# EAGLE design Keyboard (EAGLE 8.5.1)
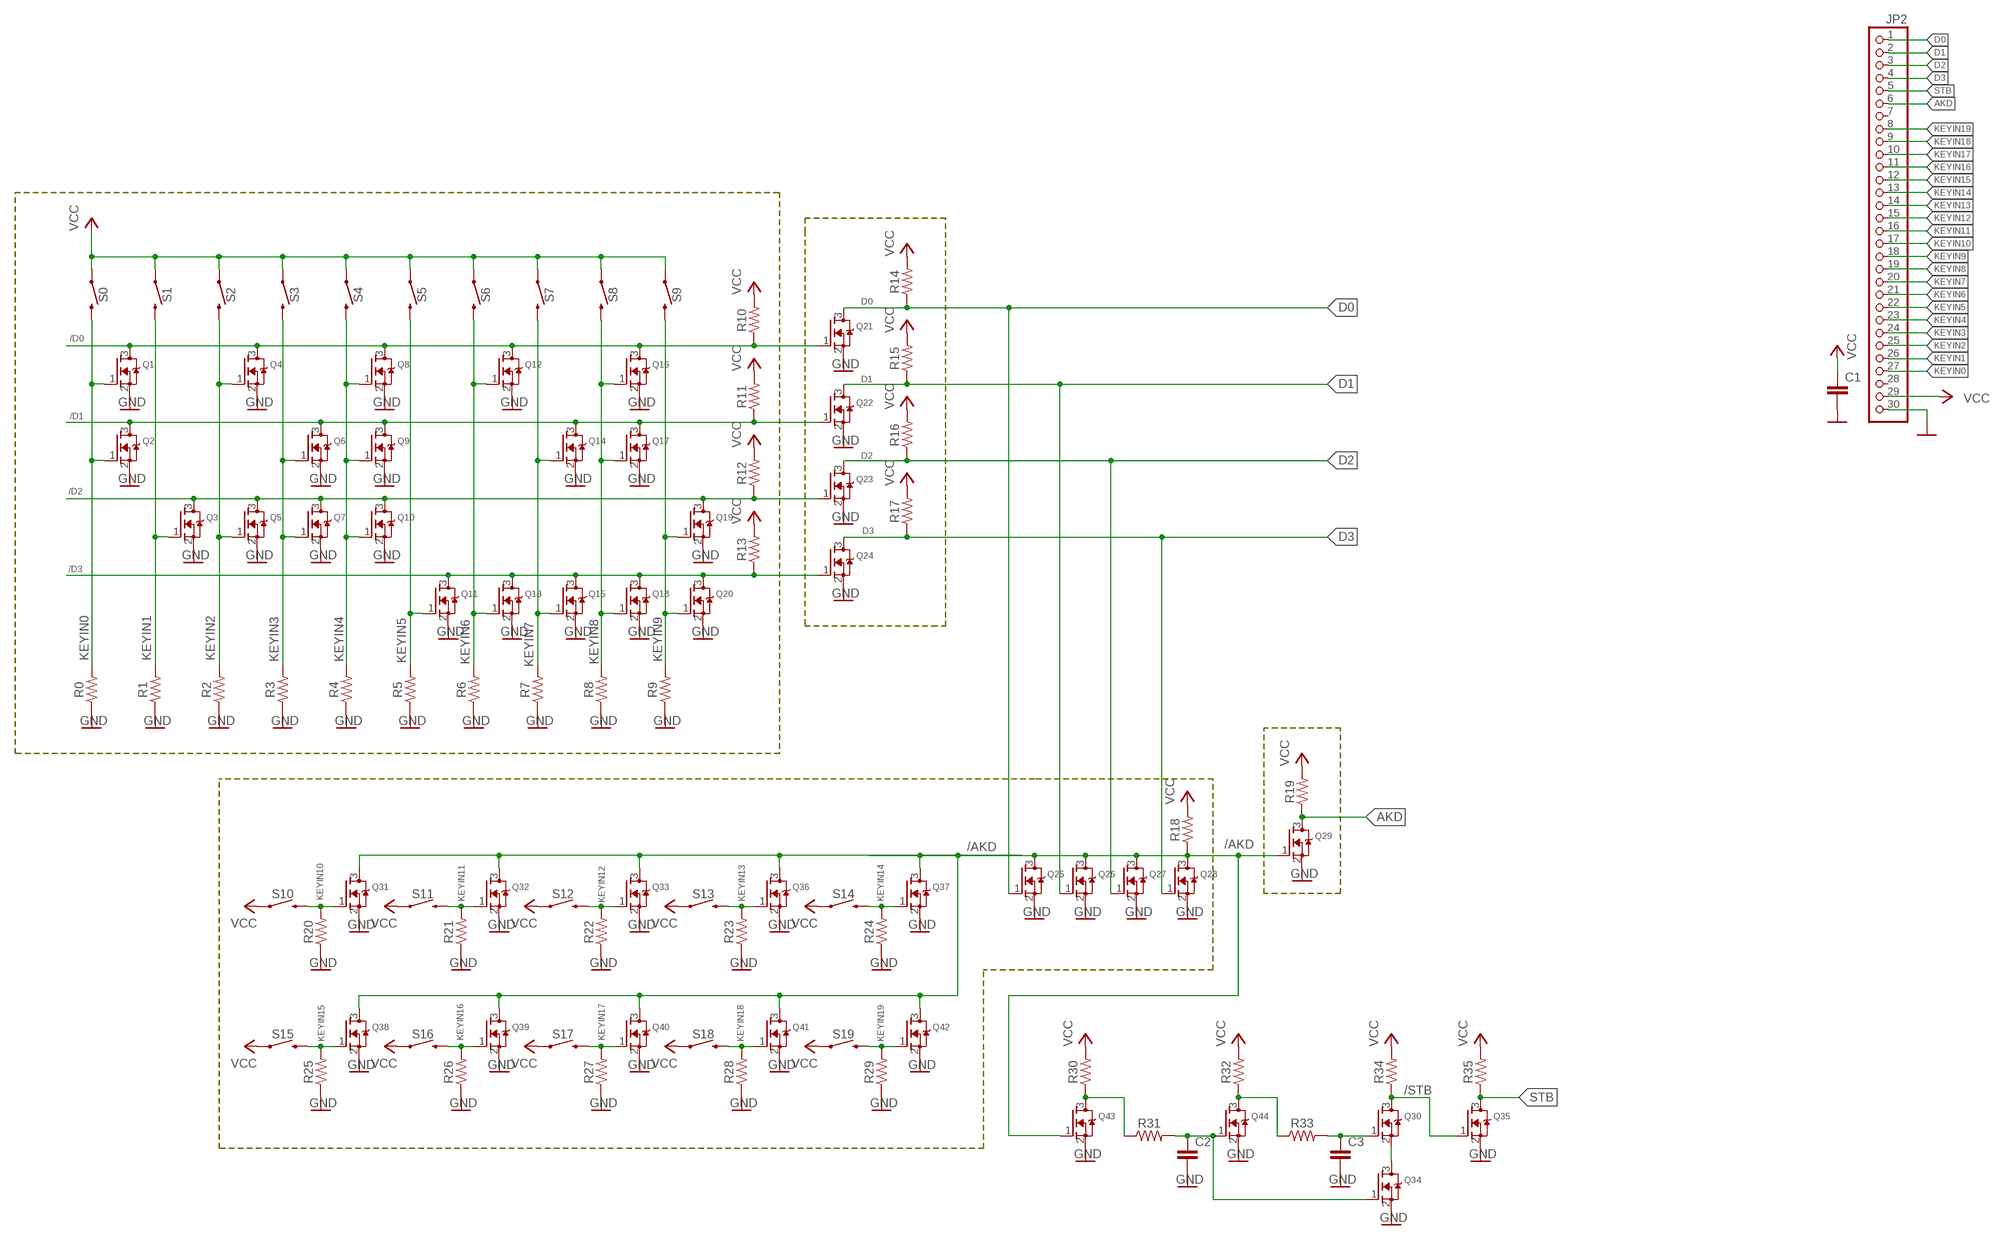
[diagram p0: schematic, sheet 1]

## Parts
C1  C-EUC0805K  [C0805K]
C2  C-EUC0805K  [C0805K]
C3  C-EUC0805K  [C0805K]
JP2  PINHD-1X30  [1X30]
Q1  NMOSREFLOW  [SOT23]
Q2  NMOSREFLOW  [SOT23]
Q3  NMOSREFLOW  [SOT23]
Q4  NMOSREFLOW  [SOT23]
Q5  NMOSREFLOW  [SOT23]
Q6  NMOSREFLOW  [SOT23]
Q7  NMOSREFLOW  [SOT23]
Q8  NMOSREFLOW  [SOT23]
Q9  NMOSREFLOW  [SOT23]
Q10  NMOSREFLOW  [SOT23]
Q11  NMOSREFLOW  [SOT23]
Q12  NMOSREFLOW  [SOT23]
Q13  NMOSREFLOW  [SOT23]
Q14  NMOSREFLOW  [SOT23]
Q15  NMOSREFLOW  [SOT23]
Q16  NMOSREFLOW  [SOT23]
Q17  NMOSREFLOW  [SOT23]
Q18  NMOSREFLOW  [SOT23]
Q19  NMOSREFLOW  [SOT23]
Q20  NMOSREFLOW  [SOT23]
Q21  NMOSREFLOW  [SOT23]
Q22  NMOSREFLOW  [SOT23]
Q23  NMOSREFLOW  [SOT23]
Q24  NMOSREFLOW  [SOT23]
Q25  NMOSREFLOW  [SOT23]
Q26  NMOSREFLOW  [SOT23]
Q27  NMOSREFLOW  [SOT23]
Q28  NMOSREFLOW  [SOT23]
Q29  NMOSREFLOW  [SOT23]
Q30  NMOSREFLOW  [SOT23]
Q31  NMOSREFLOW  [SOT23]
Q32  NMOSREFLOW  [SOT23]
Q33  NMOSREFLOW  [SOT23]
Q34  NMOSREFLOW  [SOT23]
Q35  NMOSREFLOW  [SOT23]
Q36  NMOSREFLOW  [SOT23]
Q37  NMOSREFLOW  [SOT23]
Q38  NMOSREFLOW  [SOT23]
Q39  NMOSREFLOW  [SOT23]
Q40  NMOSREFLOW  [SOT23]
Q41  NMOSREFLOW  [SOT23]
Q42  NMOSREFLOW  [SOT23]
Q43  NMOSREFLOW  [SOT23]
Q44  NMOSREFLOW  [SOT23]
R0  RESISTOR0805  [0805]
R1  RESISTOR0805  [0805]
R2  RESISTOR0805  [0805]
R3  RESISTOR0805  [0805]
R4  RESISTOR0805  [0805]
R5  RESISTOR0805  [0805]
R6  RESISTOR0805  [0805]
R7  RESISTOR0805  [0805]
R8  RESISTOR0805  [0805]
R9  RESISTOR0805  [0805]
R10  RESISTOR0805  [0805]
R11  RESISTOR0805  [0805]
R12  RESISTOR0805  [0805]
R13  RESISTOR0805  [0805]
R14  RESISTOR0805  [0805]
R15  RESISTOR0805  [0805]
R16  RESISTOR0805  [0805]
R17  RESISTOR0805  [0805]
R18  RESISTOR0805  [0805]
R19  RESISTOR0805  [0805]
R20  RESISTOR0805  [0805]
R21  RESISTOR0805  [0805]
R22  RESISTOR0805  [0805]
R23  RESISTOR0805  [0805]
R24  RESISTOR0805  [0805]
R25  RESISTOR0805  [0805]
R26  RESISTOR0805  [0805]
R27  RESISTOR0805  [0805]
R28  RESISTOR0805  [0805]
R29  RESISTOR0805  [0805]
R30  RESISTOR0805  [0805]
R31  RESISTOR0805  [0805]
R32  RESISTOR0805  [0805]
R33  RESISTOR0805  [0805]
R34  RESISTOR0805  [0805]
R35  RESISTOR0805  [0805]
S0  MOMENTARY-SWITCH-SPST-PTH-6.0MM  [TACTILE_SWITCH_PTH_6.0MM]
S1  MOMENTARY-SWITCH-SPST-PTH-6.0MM  [TACTILE_SWITCH_PTH_6.0MM]
S2  MOMENTARY-SWITCH-SPST-PTH-6.0MM  [TACTILE_SWITCH_PTH_6.0MM]
S3  MOMENTARY-SWITCH-SPST-PTH-6.0MM  [TACTILE_SWITCH_PTH_6.0MM]
S4  MOMENTARY-SWITCH-SPST-PTH-6.0MM  [TACTILE_SWITCH_PTH_6.0MM]
S5  MOMENTARY-SWITCH-SPST-PTH-6.0MM  [TACTILE_SWITCH_PTH_6.0MM]
S6  MOMENTARY-SWITCH-SPST-PTH-6.0MM  [TACTILE_SWITCH_PTH_6.0MM]
S7  MOMENTARY-SWITCH-SPST-PTH-6.0MM  [TACTILE_SWITCH_PTH_6.0MM]
S8  MOMENTARY-SWITCH-SPST-PTH-6.0MM  [TACTILE_SWITCH_PTH_6.0MM]
S9  MOMENTARY-SWITCH-SPST-PTH-6.0MM  [TACTILE_SWITCH_PTH_6.0MM]
S10  MOMENTARY-SWITCH-SPST-PTH-6.0MM  [TACTILE_SWITCH_PTH_6.0MM]
S11  MOMENTARY-SWITCH-SPST-PTH-6.0MM  [TACTILE_SWITCH_PTH_6.0MM]
S12  MOMENTARY-SWITCH-SPST-PTH-6.0MM  [TACTILE_SWITCH_PTH_6.0MM]
S13  MOMENTARY-SWITCH-SPST-PTH-6.0MM  [TACTILE_SWITCH_PTH_6.0MM]
S14  MOMENTARY-SWITCH-SPST-PTH-6.0MM  [TACTILE_SWITCH_PTH_6.0MM]
S15  MOMENTARY-SWITCH-SPST-PTH-6.0MM  [TACTILE_SWITCH_PTH_6.0MM]
S16  MOMENTARY-SWITCH-SPST-PTH-6.0MM  [TACTILE_SWITCH_PTH_6.0MM]
S17  MOMENTARY-SWITCH-SPST-PTH-6.0MM  [TACTILE_SWITCH_PTH_6.0MM]
S18  MOMENTARY-SWITCH-SPST-PTH-6.0MM  [TACTILE_SWITCH_PTH_6.0MM]
S19  MOMENTARY-SWITCH-SPST-PTH-6.0MM  [TACTILE_SWITCH_PTH_6.0MM]

## Nets
/AKD: Q25.3(D) Q26.3(D) Q27.3(D) Q28.3(D) Q29.1(G) Q31.3(D) Q32.3(D) Q33.3(D) Q36.3(D) Q37.3(D) Q38.3(D) Q39.3(D) Q40.3(D) Q41.3(D) Q42.3(D) Q43.1(G) R18.1
/D0: Q1.3(D) Q4.3(D) Q8.3(D) Q12.3(D) Q16.3(D) Q21.1(G) R10.1
/D1: Q2.3(D) Q6.3(D) Q9.3(D) Q14.3(D) Q17.3(D) Q22.1(G) R11.1
/D2: Q3.3(D) Q5.3(D) Q7.3(D) Q10.3(D) Q19.3(D) Q23.1(G) R12.1
/D3: Q11.3(D) Q13.3(D) Q15.3(D) Q18.3(D) Q20.3(D) Q24.1(G) R13.1
/STB: Q30.3(D) Q35.1(G) R34.1
AKD: JP2.6 Q29.3(D) R19.1
D0: JP2.1 Q21.3(D) Q25.1(G) R14.1
D1: JP2.2 Q22.3(D) Q26.1(G) R15.1
D2: JP2.3 Q23.3(D) Q27.1(G) R16.1
D3: JP2.4 Q24.3(D) Q28.1(G) R17.1
GND: C1.2 C2.2 C3.2 JP2.30 Q1.2(S) Q2.2(S) Q3.2(S) Q4.2(S) Q5.2(S) Q6.2(S) Q7.2(S) Q8.2(S) Q9.2(S) Q10.2(S) Q11.2(S) Q12.2(S) Q13.2(S) Q14.2(S) Q15.2(S) Q16.2(S) Q17.2(S) Q18.2(S) Q19.2(S) Q20.2(S) Q21.2(S) Q22.2(S) Q23.2(S) Q24.2(S) Q25.2(S) Q26.2(S) Q27.2(S) Q28.2(S) Q29.2(S) Q31.2(S) Q32.2(S) Q33.2(S) Q34.2(S) Q35.2(S) Q36.2(S) Q37.2(S) Q38.2(S) Q39.2(S) Q40.2(S) Q41.2(S) Q42.2(S) Q43.2(S) Q44.2(S) R0.1 R1.1 R2.1 R3.1 R4.1 R5.1 R6.1 R7.1 R8.1 R9.1 R20.1 R21.1 R22.1 R23.1 R24.1 R25.1 R26.1 R27.1 R28.1 R29.1
KEYIN0: JP2.27 Q1.1(G) Q2.1(G) R0.2 S0.3
KEYIN1: JP2.26 Q3.1(G) R1.2 S1.3
KEYIN2: JP2.25 Q4.1(G) Q5.1(G) R2.2 S2.3
KEYIN3: JP2.24 Q6.1(G) Q7.1(G) R3.2 S3.3
KEYIN4: JP2.23 Q8.1(G) Q9.1(G) Q10.1(G) R4.2 S4.3
KEYIN5: JP2.22 Q11.1(G) R5.2 S5.3
KEYIN6: JP2.21 Q12.1(G) Q13.1(G) R6.2 S6.3
KEYIN7: JP2.20 Q14.1(G) Q15.1(G) R7.2 S7.3
KEYIN8: JP2.19 Q16.1(G) Q17.1(G) Q18.1(G) R8.2 S8.3
KEYIN9: JP2.18 Q19.1(G) Q20.1(G) R9.2 S9.3
KEYIN10: JP2.17 Q31.1(G) R20.2 S10.3
KEYIN11: JP2.16 Q32.1(G) R21.2 S11.3
KEYIN12: JP2.15 Q33.1(G) R22.2 S12.3
KEYIN13: JP2.14 Q36.1(G) R23.2 S13.3
KEYIN14: JP2.13 Q37.1(G) R24.2 S14.3
KEYIN15: JP2.12 Q38.1(G) R25.2 S15.3
KEYIN16: JP2.11 Q39.1(G) R26.2 S16.3
KEYIN17: JP2.10 Q40.1(G) R27.2 S17.3
KEYIN18: JP2.9 Q41.1(G) R28.2 S18.3
KEYIN19: JP2.8 Q42.1(G) R29.2 S19.3
N$1: Q43.3(D) R30.1 R31.1
N$17: Q44.3(D) R32.1 R33.1
N$23: C3.1 Q30.1(G) R33.2
N$24: C2.1 Q34.1(G) Q44.1(G) R31.2
N$25: Q30.2(S) Q34.3(D)
STB: JP2.5 Q35.3(D) R35.1
VCC: C1.1 JP2.29 R10.2 R11.2 R12.2 R13.2 R14.2 R15.2 R16.2 R17.2 R18.2 R19.2 R30.2 R32.2 R34.2 R35.2 S0.1 S1.1 S2.1 S3.1 S4.1 S5.1 S6.1 S7.1 S8.1 S9.1 S10.1 S11.1 S12.1 S13.1 S14.1 S15.1 S16.1 S17.1 S18.1 S19.1
Unconnected: JP2.7 JP2.28

## Library data of the parts
C1-C3 = rcl:C-EU: CAPACITOR, European symbol; SPICEPREFIX: C
JP2 = XSNOR:PINHD-1X30: PIN HEADER
Q1-Q44 = XSNOR:NMOS: N-Channel Mosfet 2N7002E - 60V 260mA SOT23 [Digikey: 2N7002ET1GOSTR-ND] - REEL BSH103 - 30V 850mA SOT23 [Digikey: 568-5013-1-ND]
R0 R1-R35 = XSNOR:RESISTOR: Generic Resistor Package
S0 S1-S19 = SparkFun-Switches:MOMENTARY-SWITCH-SPST: Momentary Switch (Pushbutton) - SPST Normally-open (NO) SPST momentary switches (buttons, pushbuttons). Variants PTH-12MM - 12mm square, through-hole Momentary Pushbutton Switch - 12mm Square <https://www.sparkfun.com/products/9190> (COM-09190) PTH-6.0MM, PTH-6.0MM-KIT - 6.0mm square, through-hole Mini Pushbutton Switch <https://www.sparkfun.com/products/97> (COM-00097) KIT package intended for soldering kit's - only one side of pads' copper is exposed. PTH-RIGHT-ANGLE-KIT - Right-angle, through-hole Right Angle Tactile Button <https://www.sparkfun.com/products/10791> - Used on SparkFun BigTime Watch Kit <https://www.sparkfun.com/products/11734> SMD-12MM - 12mm square, surface-mount Tactile Button - SMD (12mm) <https://www.sparkfun.com/products/12993> (COM-12993) Used on SparkFun PicoBoard <https://www.sparkfun.com/products/11888> SMD-4.5MM - 4.5mm Square Trackball Switch Used on SparkFun Blackberry Trackballer Breakout <https://www.sparkfun.com/products/13169> SMD-4.6MMX2.8MM - 4.60mm x 2.80mm, surface mount Used on SparkFun SAMD21 Mini Breakout <https://www.sparkfun.com/products/13664> SMD-5.2MM, SMD-5.2-REDUNDANT - 5.2mm square, surface-mount Mini Pushbutton Switch - SMD <https://www.sparkfun.com/products/8720> (COM-08720) Used on Arduino Pro Mini <https://www.sparkfun.com/products/11114> REDUNDANT package connects both switch circuits together SMD-6.0X3.5MM - 6.0 x 3.5mm, surface mount Momentary Reset Switch SMD <https://www.sparkfun.com/products/8229> (COM-08229) SMD-6.2MM-TALL - 6.2mm square, surface mount Tactile Button - SMD (6mm) <https://www.sparkfun.com/products/12992> Used on SparkFun Digital Sandbox <https://www.sparkfun.com/products/12651> SMD-RIGHT-ANGLE - Right-angle, surface mount Used on SparkFun Block for Intel® Edison - Arduino <https://www.sparkfun.com/products/13036>; PROD_ID: SWCH-08441; SF_SKU: COM-00097

## Net classes
0 default: width 0.2 mm, drill 0.305 mm, clearance 0.2 mm

## Board
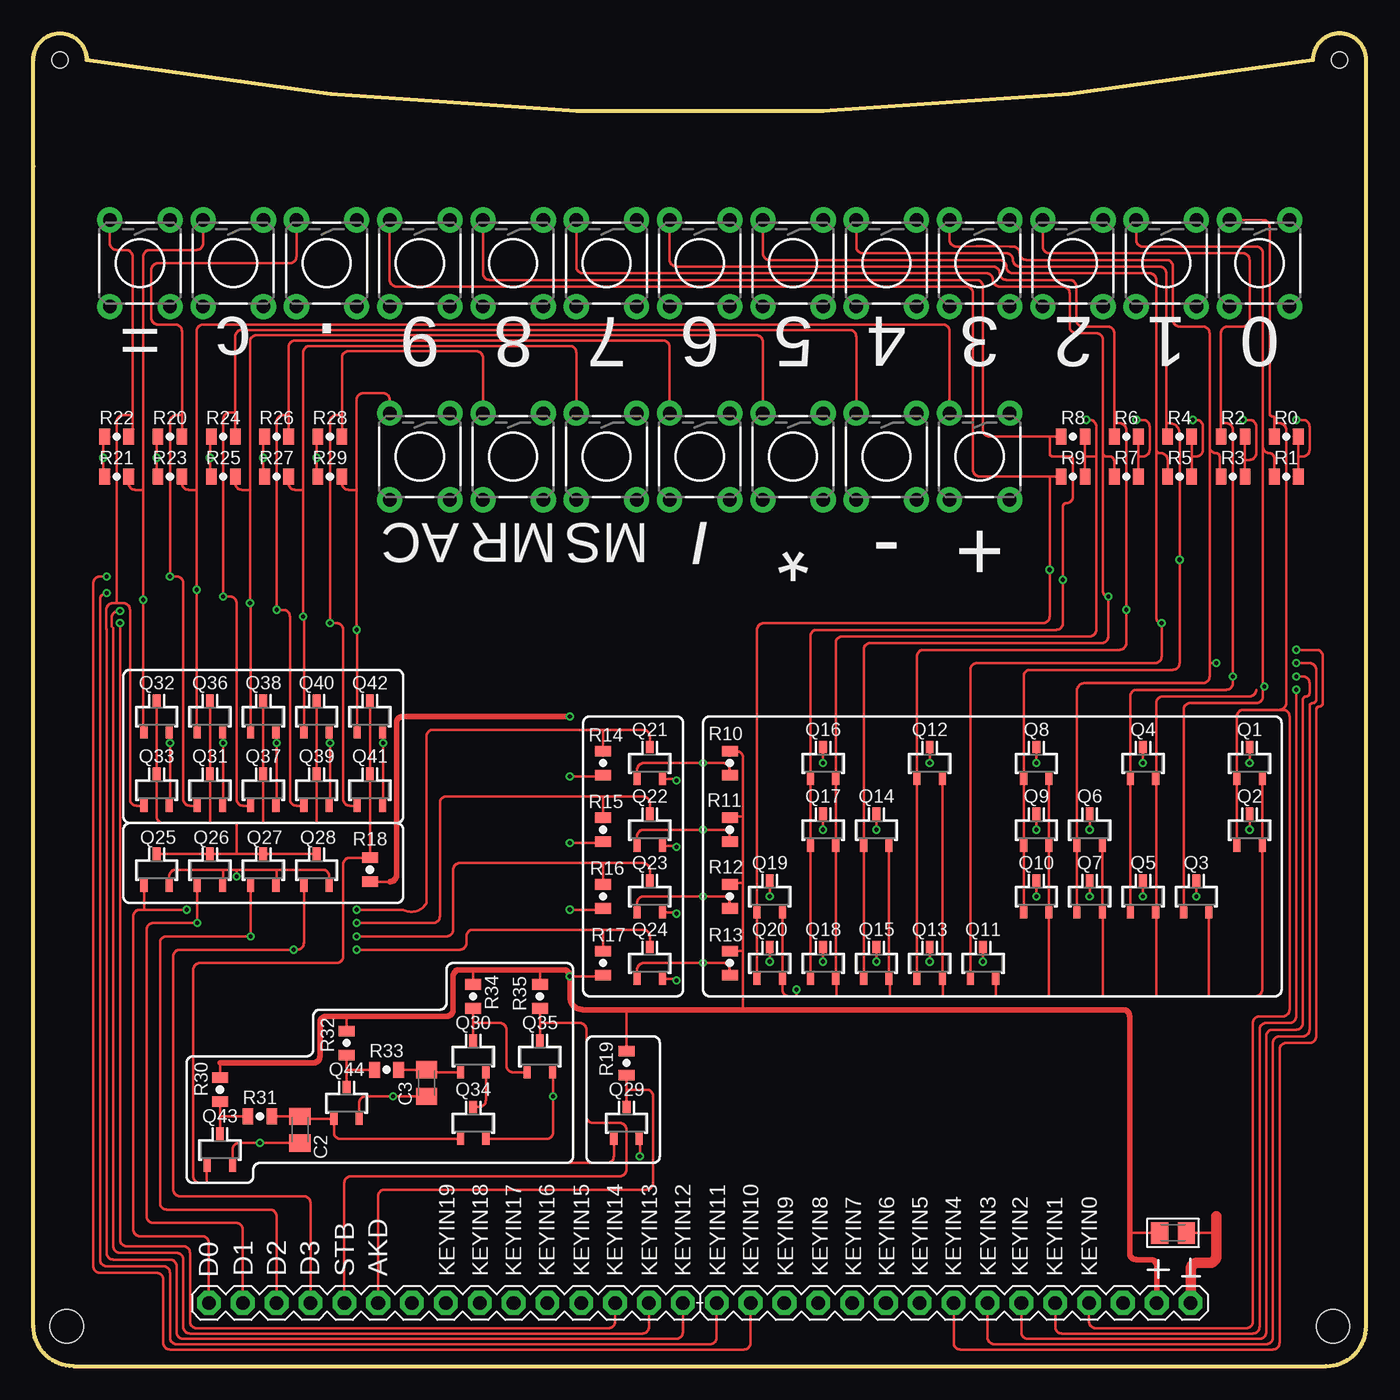
[diagram p1: board, top side]
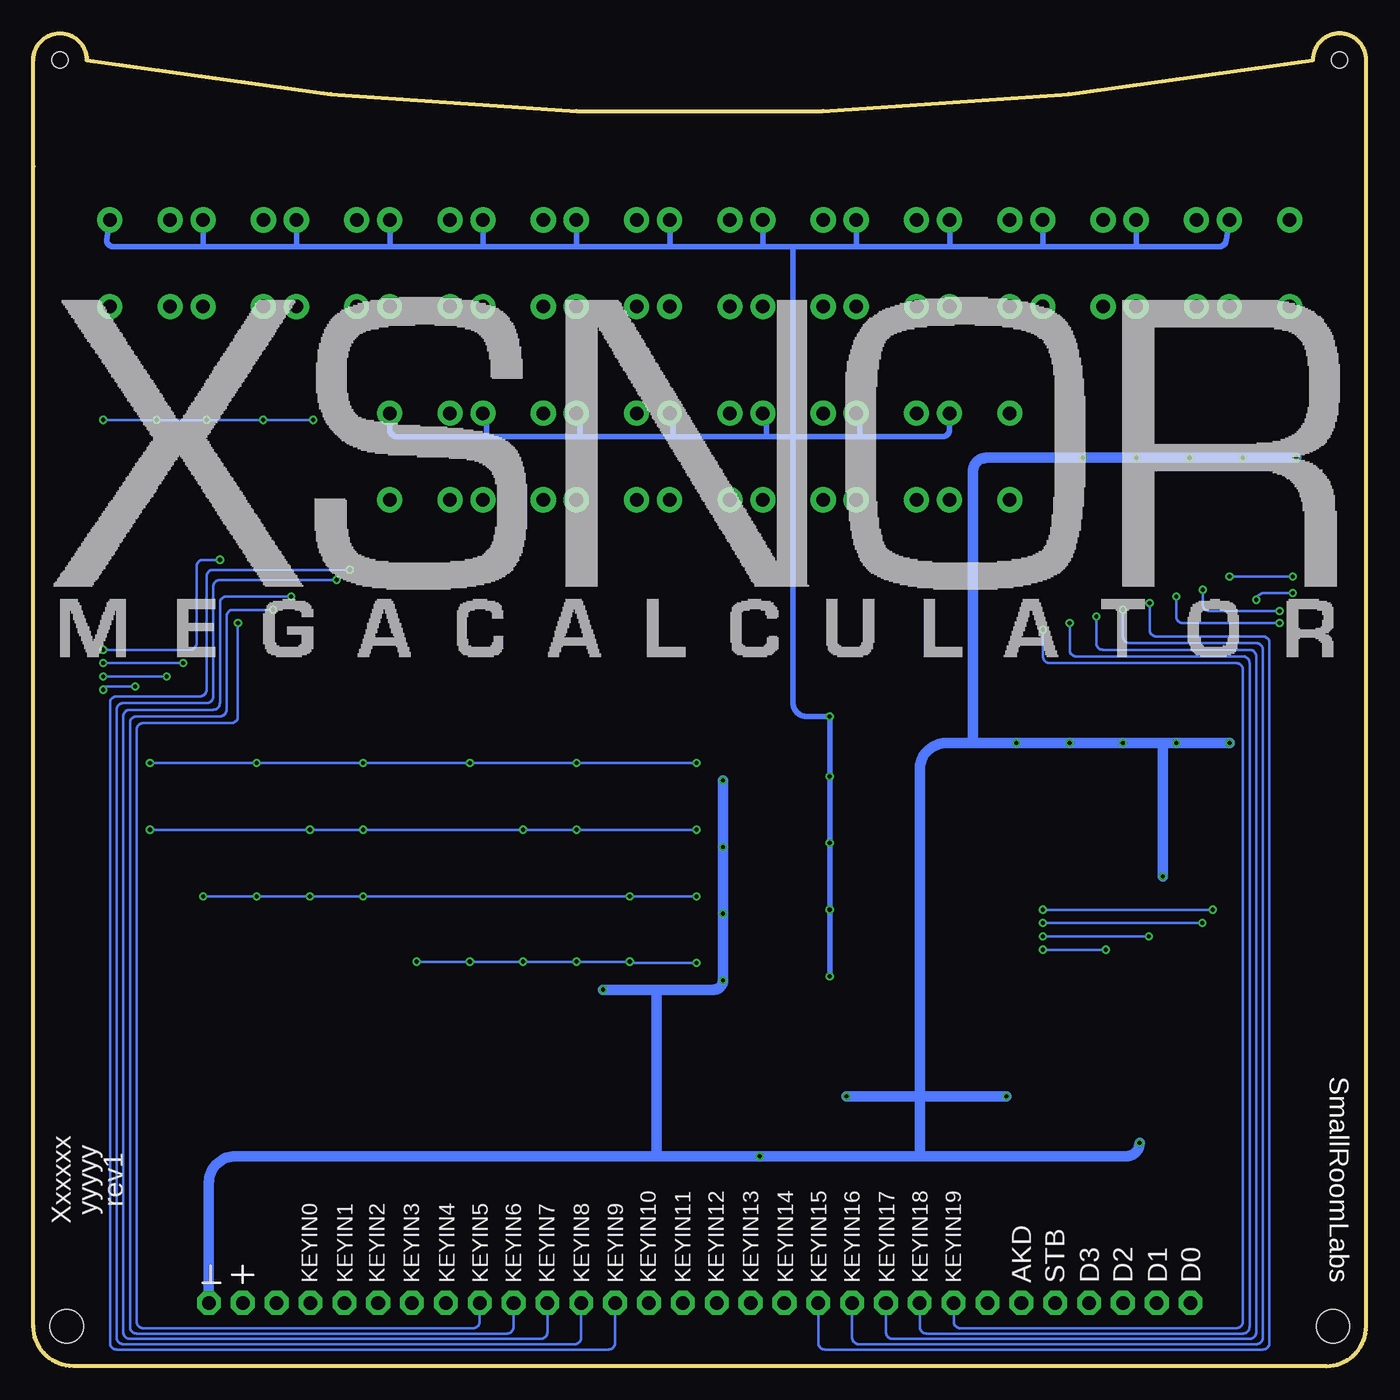
[diagram p2: board, bottom side, seen from below]

Size 100 x 100 mm. Coordinates in mm from the lower left corner, seen from the top.
Outline: 3,0 arc-90 0,3 0,90 0,98 arc-90 2,100 arc-90 4,98 arc20 96,98 arc-90 98,100 arc-90 100,98 100,90 100,3 arc-90 97,0 3,0
Copper layers (1*16): Top 0.035mm / dielectric 1.5mm / Bottom 0.035mm
Design rules "dirt_cheap_dirty_boards.v1": minimum track width 5mil, minimum drill 12mil, track to track 5mil, track to pad 5mil, pad to pad 5mil, via to via 5mil, smd to smd 0mil, copper to edge 10mil, drill to drill 10mil, minimum pad ring 10mil, minimum via ring 6mil, stop-mask expansion 2mil, vias tented up to drill 25mil, thermal gap 10mil
Holes 2.5 mm at 2.5,3 97.5,3
Holes 1.2 mm at 2,98 98,98

### Footprints (pad centres in the part's own frame; a part is rotated, then mirrored left to right if it is on the bottom)
C0805K = smd 1.3 x 1.6: 1 -1,0; 2 1,0
1X30 = drill 1.016 pad 1.778 octagon: 1 -36.83,0; 2 -34.29,0; 3 -31.75,0; 4 -29.21,0; 5 -26.67,0; 6 -24.13,0; 7 -21.59,0; 8 -19.05,0; 9 -16.51,0; 10 -13.97,0; 11 -11.43,0; 12 -8.89,0; 13 -6.35,0; 14 -3.81,0; 15 -1.27,0; 16 1.27,0; 17 3.81,0; 18 6.35,0; 19 8.89,0; 20 11.43,0; 21 13.97,0; 22 16.51,0; 23 19.05,0; 24 21.59,0; 25 24.13,0; 26 26.67,0; 27 29.21,0; 28 31.75,0; 29 34.29,0; 30 36.83,0
SOT23 = smd 0.6 x 0.9: 1 -0.95,-1.2; 2 0.95,-1.2 | smd 0.65 x 0.9: 3 0,1.2
0805 = smd 0.8 x 1.2: 1 -0.9,0; 2 0.9,0
TACTILE_SWITCH_PTH_6.0MM = drill 1.016 pad 1.88: 1 -3.251,2.261; 2 3.251,2.261; 3 -3.251,-2.261; 4 3.251,-2.261

### Placement (x,y rotation side)
C1  85.5,10 0 top
C2  20,17.75 270 top
C3  29.5,21.25 270 top
JP2  50,4.75 0 top
Q1  91.25,45.25 0 top
Q2  91.25,40.25 0 top
Q3  87.25,35.25 0 top
Q4  83.25,45.25 0 top
Q5  83.25,35.25 0 top
Q6  79.25,40.25 0 top
Q7  79.25,35.25 0 top
Q8  75.25,45.25 0 top
Q9  75.25,40.25 0 top
Q10  75.25,35.25 0 top
Q11  71.25,30.25 0 top
Q12  67.25,45.25 0 top
Q13  67.25,30.25 0 top
Q14  63.25,40.25 0 top
Q15  63.25,30.25 0 top
Q16  59.25,45.25 0 top
Q17  59.25,40.25 0 top
Q18  59.25,30.25 0 top
Q19  55.25,35.25 0 top
Q20  55.25,30.25 0 top
Q21  46.25,45.25 0 top
Q22  46.25,40.25 0 top
Q23  46.25,35.25 0 top
Q24  46.25,30.25 0 top
Q25  9.25,37.25 0 top
Q26  13.25,37.25 0 top
Q27  17.25,37.25 0 top
Q28  21.25,37.25 0 top
Q29  44.5,18.25 0 top
Q30  33,23.25 0 top
Q31  13.25,43.25 0 top
Q32  9.25,48.75 0 top
Q33  9.25,43.25 0 top
Q34  33,18.25 0 top
Q35  38,23.25 0 top
Q36  13.25,48.75 0 top
Q37  17.25,43.25 0 top
Q38  17.25,48.75 0 top
Q39  21.25,43.25 0 top
Q40  21.25,48.75 0 top
Q41  25.25,43.25 0 top
Q42  25.25,48.75 0 top
Q43  14,16.25 0 top
Q44  23.5,19.75 0 top
R0  94,69.75 180 top
R1  94,66.75 180 top
R2  90,69.75 180 top
R3  90,66.75 180 top
R4  86,69.75 180 top
R5  86,66.75 180 top
R6  82,69.75 180 top
R7  82,66.75 180 top
R8  78,69.75 180 top
R9  78,66.75 180 top
R10  52.25,45.25 90 top
R11  52.25,40.25 90 top
R12  52.25,35.25 90 top
R13  52.25,30.25 90 top
R14  42.75,45.25 270 top
R15  42.75,40.25 270 top
R16  42.75,35.25 270 top
R17  42.75,30.25 270 top
R18  25.25,37.25 270 top
R19  44.5,22.75 90 top
R20  10.25,69.75 0 top
R21  6.25,66.75 0 top
R22  6.25,69.75 0 top
R23  10.25,66.75 0 top
R24  14.25,69.75 0 top
R25  14.25,66.75 0 top
R26  18.25,69.75 0 top
R27  18.25,66.75 0 top
R28  22.25,69.75 0 top
R29  22.25,66.75 0 top
R30  14,20.75 90 top
R31  17,18.75 0 top
R32  23.5,24.25 90 top
R33  26.5,22.25 0 top
R34  33,27.75 90 top
R35  38,27.75 90 top
S0  92,82.75 270 top
S1  85,82.75 270 top
S2  78,82.75 270 top
S3  71,82.75 270 top
S4  64,82.75 270 top
S5  57,82.75 270 top
S6  50,82.75 270 top
S7  43,82.75 270 top
S8  36,82.75 270 top
S9  29,82.75 270 top
S10  22,82.75 270 top
S11  15,82.75 270 top
S12  8,82.75 270 top
S13  71,68.25 270 top
S14  64,68.25 270 top
S15  57,68.25 270 top
S16  50,68.25 270 top
S17  43,68.25 270 top
S18  36,68.25 270 top
S19  29,68.25 270 top

### Tracks (layer width: path | path; a pad name or v marks a point on that pad's centre or on a via)
/AKD
  Top 0.2: Q32.3 Q33.3 9.25,41.25 arc90 9.75,40.75 13.25,40.75 | Q36.3 Q31.3 13.25,40.75 | Q38.3 Q37.3 17.25,40.75 | Q40.3 Q39.3 21.25,40.75 | Q25.3 Q26.3 15.25,38.45 | 15.25,38.45 Q27.3 Q28.3 | Q42.3 Q41.3 25.25,41.25 25.25,40.75 | 13.25,40.75 15.25,40.75 | 15.25,40.75 17.25,40.75 | 17.25,40.75 21.25,40.75 | 15.25,38.45 15.25,40.75 | 25.25,40.75 R18.1 23.75,38.15 arc90 23.25,37.65 23.25,32.25 23.25,30.75 arc-90 22.75,30.25 12.5,30.25 arc90 12,29.75 12,14.25 arc90 12.5,13.75 13,13.75 | 21.25,40.75 25.25,40.75 | 13,15 arc-90 Q43.1 arc90 13,15 | Q29.1 43.55,15.75 arc-90 43.05,15.25 17,15.25 arc90 16.5,14.75 16.5,14.25 arc-90 16,13.75 13,13.75 | 13,15 13,13.75
/D0  (via drill 0.3 pad 0.3)
  Top 0.2: Q21.1 45.3,44.75 arc-90 45.8,45.25 v50.25,45.25 51.75,45.25 arc-90 52.25,44.75 R10.1 | v59.25,45.25 Q16.3 | Q12.3 v67.25,45.25 | Q8.3 v75.25,45.25 | Q4.3 v83.25,45.25 | Q1.3 v91.25,45.25
  Bottom 0.2: v91.25,45.25 v83.25,45.25 v75.25,45.25 v67.25,45.25 v59.25,45.25 v50.25,45.25
/D1  (via drill 0.3 pad 0.3)
  Top 0.2: Q22.1 45.3,39.75 arc-90 45.8,40.25 v50.25,40.25 51.75,40.25 arc-90 52.25,39.75 R11.1 | v91.25,40.25 Q2.3 | v79.25,40.25 Q6.3 | v75.25,40.25 Q9.3 | v59.25,40.25 Q17.3 | v63.25,40.25 Q14.3
  Bottom 0.2: v50.25,40.25 v59.25,40.25 v63.25,40.25 v75.25,40.25 v79.25,40.25 v91.25,40.25
/D2  (via drill 0.3 pad 0.3)
  Top 0.2: Q23.1 45.3,34.75 arc-90 45.8,35.25 v50.25,35.25 51.75,35.25 arc-90 52.25,34.75 R12.1 | v87.25,35.25 Q3.3 | v83.25,35.25 Q5.3 | v79.25,35.25 Q7.3 | v75.25,35.25 Q10.3 | v55.25,35.25 Q19.3
  Bottom 0.2: v87.25,35.25 v83.25,35.25 v79.25,35.25 v75.25,35.25 v55.25,35.25 v50.25,35.25
/D3  (via drill 0.3 pad 0.3)
  Top 0.2: Q20.3 v55.25,30.35 | Q18.3 v59.25,30.35 | Q15.3 v63.25,30.35 | Q13.3 v67.25,30.35 | Q11.3 v71.25,30.35 | Q24.1 45.3,29.75 arc-90 45.8,30.25 v50.25,30.25 51.75,30.25 arc-90 52.25,29.75 R13.1
  Bottom 0.2: v71.25,30.35 v67.25,30.35 v63.25,30.35 v59.25,30.35 v55.25,30.35 arc-90 55.15,30.25 v50.25,30.25
/STB
  Top 0.2: Q30.3 33,25.75 | 33,25.75 R34.1 | 33,25.75 35,25.75 arc-90 35.5,25.25 35.5,22.55 arc90 36,22.05 Q35.1
AKD
  Top 0.2: Q29.3 44.5,20.25 44.5,20.75 | 44.5,20.75 R19.1 | 44.5,20.75 46,20.75 arc-90 46.5,20.25 46.5,13.75 arc-90 46,13.25 26.37,13.25 arc90 25.87,12.75 JP2.6
D0  (via drill 0.3 pad 0.3)
  Top 0.2: Q21.3 46.25,47.25 arc90 45.75,47.75 42.75,47.75 | 42.75,47.75 40.75,47.75 | 40.75,47.75 40.25,47.75 | R14.1 42.75,47.75 | 8.3,34.25 v11.5,34.25 | v24.25,34.25 27.75,34.25 arc90 29.5,34.75 29.5,47.25 arc-90 30,47.75 40.75,47.75 | JP2.1 13.17,9.25 arc90 12.67,9.75 8,9.75 arc-90 7.5,10.25 7.5,33.75 arc-90 8,34.25 8.3,34.25 | Q25.1 8.3,34.25
  Bottom 0.2: v11.5,34.25 v24.25,34.25
D1  (via drill 0.3 pad 0.3)
  Top 0.2: Q26.1 v12.3,33.25 9,33.25 arc90 8.5,32.75 8.5,11.25 arc90 9,10.75 15.21,10.75 arc-90 15.71,10.25 JP2.2 | Q22.3 46.25,42.25 arc90 45.75,42.75 42.75,42.75 | R15.1 42.75,42.75 | v24.25,33.25 30,33.25 arc90 30.5,33.75 30.5,42.25 arc-90 31,42.75 42.75,42.75
  Bottom 0.2: v24.25,33.25 v12.3,33.25
D2  (via drill 0.3 pad 0.3)
  Top 0.2: Q27.1 v16.3,32.25 10,32.25 arc90 9.5,31.75 9.5,12.25 arc90 10,11.75 17.75,11.75 arc-90 18.25,11.25 JP2.3 | Q23.3 46.25,37.25 arc90 45.75,37.75 42.75,37.75 | R16.1 42.75,37.75 | v24.25,32.25 31,32.25 arc90 31.5,32.75 31.5,37.25 arc-90 32,37.75 42.75,37.75
  Bottom 0.2: v24.25,32.25 v16.3,32.25
D3  (via drill 0.3 pad 0.3)
  Top 0.2: Q24.3 46.25,32.25 arc90 45.75,32.75 42.75,32.75 | R17.1 42.75,32.75 | 42.75,32.75 33,32.75 arc90 32.5,32.25 32.5,31.75 arc-90 32,31.25 v24.25,31.25 | Q28.1 20.3,31.75 arc-90 19.8,31.25 v19.54,31.25 11,31.25 arc90 10.5,30.75 10.5,13.25 arc90 11,12.75 20.29,12.75 arc-90 20.79,12.25 JP2.4
  Bottom 0.2: v24.25,31.25 v19.54,31.25
GND  (via drill 0.3, 0.3 pad 0.3)
  Top 0.2: Q25.2 10.2,36.75 arc-90 10.7,37.25 14.25,37.25 | Q28.2 22.2,36.75 arc90 21.7,37.25 18.25,37.25 | 14.25,37.25 15.25,37.25 | 15.25,37.25 18.25,37.25 | Q26.2 arc90 14.25,36.1 14.25,37.25 | Q27.2 arc90 18.25,36.1 18.25,37.25 | 14.25,42 arc90 Q31.2 14.25,42.05 v14.25,46.75 14.25,47.55 Q36.2 arc90 14.25,47.6 | 18.25,42 arc90 Q37.2 18.25,42.05 v18.25,46.75 18.25,47.55 Q38.2 arc90 18.25,47.6 | 26.25,42 arc90 Q41.2 26.25,42.05 v26.25,46.75 26.25,47.55 Q42.2 arc90 26.25,47.6 | Q24.2 48.15,29.05 arc-90 v48.25,28.95 | Q23.2 48.15,34.05 arc-90 v48.25,33.95 | Q22.2 48.15,39.05 arc-90 v48.25,38.95 | Q21.2 48.15,44.05 arc-90 v48.25,43.95 | Q19.2 Q20.2 56.2,28.25 arc90 56.7,27.75 57.25,27.75 | Q16.2 60.2,44 | 60.2,44 Q17.2 Q18.2 arc-90 60.25,29 60.25,27.75 | Q14.2 Q15.2 arc-90 64.25,29 64.25,27.75 | Q12.2 Q13.2 arc-90 68.25,29 68.25,27.75 | 57.25,27.75 60.25,27.75 | 60.25,27.75 64.25,27.75 | 64.25,27.75 68.25,27.75 | 68.25,27.75 72.25,27.75 | 72.25,27.75 76.25,27.75 | 76.25,27.75 78.25,27.75 80.25,27.75 | 80.25,27.75 84.25,27.75 | 84.25,27.75 87.25,27.75 | 87.25,27.75 87.7,27.75 | Q5.2 arc-90 84.25,34 84.25,33.75 | 84.25,33.75 84.25,27.75 | 80.25,27.75 80.25,34 arc90 Q7.2 Q6.2 | 76.25,27.75 arc-90 76.2,27.8 Q10.2 Q9.2 76.2,44 Q8.2 | Q11.2 72.2,27.8 arc90 72.25,27.75 | Q4.2 arc-90 84.25,44 | 84.25,44 84.25,33.75 | Q1.2 Q2.2 92.2,28.25 arc-90 91.7,27.75 88.25,27.75 | 88.25,27.75 87.25,27.75 | Q3.2 88.2,27.8 arc90 88.25,27.75 | 57.25,27.75 v57.25,28.25 | R8.1 78.9,68.25 | 78.9,68.25 78.9,67.75 R9.1 | R6.1 82.9,68.25 | 82.9,68.25 82.9,67.75 R7.1 | R4.1 86.9,68.25 | 86.9,68.25 86.9,68 86.9,67.75 R5.1 | R2.1 90.9,68 | 90.9,68 90.9,67.75 R3.1
  Top 0.2: R0.1 94.9,68.25 | 94.9,68.25 R1.1 | 60.2,44 60.2,54.25 arc-90 60.7,54.75 79.25,54.75 arc90 79.75,55.25 79.75,68.25 | 84.25,44 84.25,49.75 arc-90 84.75,50.25 88.65,50.25 91.25,50.25 arc90 91.75,50.75 | C2.2 v17,16.75 15.45,16.75 arc90 14.95,16.25 Q43.2 | C3.2 v27,20.25 24.95,20.25 arc90 24.45,19.75 Q44.2 | Q34.2 38.5,17.05 arc90 39,17.55 v39,20.25 39,22 arc90 Q35.2 | v45.5,15.75 45.5,17 arc90 Q29.2 | Q33.2 10.25,42.05 v10.25,46.75 10.25,47.55 Q32.2 | Q39.2 22.25,42.05 v22.25,46.75 22.25,47.55 Q40.2 | R28.1 21.25,69.75 v21.25,68.15 21.25,66.75 R29.1 | R26.1 17.25,69.75 v17.25,68.15 17.25,66.75 R27.1 | R25.1 13.25,66.75 v13.25,68.15 13.25,69.75 R24.1 | R23.1 9.25,66.75 v9.25,68.15 9.25,69.75 R20.1 | R22.1 5.25,69.75 v5.25,68.15 5.25,66.75 R21.1 | v15.25,36.75 15.25,37.25 | C1.2 88.25,10 88.75,10 | 79.75,68.25 78.9,68.25 | 79.75,68.25 79.75,70.5 arc90 79.25,71 v79,71 | v82.75,71 83.25,71 arc-90 83.75,70.5 83.75,68.75 arc-90 83.25,68.25 82.9,68.25 | v87,71 87.25,71 arc-90 87.75,70.5 87.75,69 87.75,68.75 arc-90 87.25,68.25 86.9,68.25 | v90.75,71 91.25,71 arc-90 91.75,70.5 91.75,68.5 arc-90 91.25,68 90.9,68 | v94.75,71 95.25,71 arc-90 95.75,70.5 95.75,68.75 arc-90 95.25,68.25 94.9,68.25
  Top 0.8: JP2.30 86.83,7.25 arc-90 87.33,7.75 88.25,7.75 arc90 88.75,8.25 88.75,10 88.75,11.25
  Bottom 0.2: v79,71 v82.75,71 v87,71 v90.75,71 v94.75,71
  Bottom 0.8: v5.25,68.15 v9.25,68.15 v13.25,68.15 v17.25,68.15 20.75,68.15 v21.25,68.15 28.5,68.15 arc-90 29.5,67.15 29.5,46.75 | 15.25,46.75 v18.25,46.75 v22.25,46.75 v26.25,46.75 29.5,46.75 | 15.25,46.75 v14.25,46.75 v10.25,46.75 | v15.25,36.75 15.25,46.75 | 33.5,15.75 v45.5,15.75 53.25,15.75 | 33.5,15.75 18,15.75 arc-90 v17,16.75 | v27,20.25 33.5,20.25 | 33.5,20.25 v39,20.25 | 29.5,46.75 30.5,46.75 31.5,46.75 arc-90 33.5,44.75 33.5,20.25 | 33.5,20.25 33.5,15.75 | v48.25,43.95 v48.25,38.95 v48.25,33.95 v48.25,28.95 arc90 48.95,28.25 53.25,28.25 | 53.25,28.25 v57.25,28.25 | 53.25,15.75 84.83,15.75 arc-90 86.83,13.75 JP2.30 | 53.25,28.25 53.25,15.75
KEYIN0
  Top 0.2: S0.3 92.25,86 arc-90 92.75,85.5 92.75,71.5 arc90 93,71.25 arc-90 93.1,71.15 93.1,70.75 | JP2.27 79.21,3.35 arc90 79.71,2.85 88.5,2.85 | 88.5,2.85 88.75,2.85 | Q1.1 90.3,44 | 90.3,44 Q2.1 | 88.5,2.85 91,2.85 arc90 91.5,3.35 91.5,25.75 arc-90 92,26.25 93.75,26.25 arc90 94.25,26.75 94.25,48.75 arc90 93.75,49.25 93.25,49.25 | 93.02,69.83 arc90 R0.2 93.1,70.75 | 93.1,70.75 93.5,70.75 arc-90 94,70.25 94,60.5 94,49.75 arc-90 93.5,49.25 93.25,49.25 | 93.25,49.25 90.8,49.25 arc90 90.3,48.75 90.3,44
KEYIN1  (via drill 0.3)
  Top 0.2: JP2.26 76.67,2.95 arc90 77.17,2.45 90.25,2.45 91.5,2.45 arc90 92,2.95 92,25.25 arc-90 92.5,25.75 94.25,25.75 arc90 94.75,26.25 v94.75,50.75 | Q3.1 86.3,49.25 arc-90 86.8,49.75 91.25,49.75 91.75,49.75 arc90 92.25,50.25 92.25,51 | S1.3 82.74,84.5 arc90 83.24,84 91.75,84 arc-90 92.25,83.5 92.25,69.25 | R1.2 93.1,68.15 arc90 92.75,68.5 arc-90 92.25,69 92.25,69.25 | 92.25,69.25 92.25,62.5 | 92.25,62.5 92.25,62.25 | 92.25,61 92.25,62.25 | 92.25,62.25 92.25,61.9 | 92.25,62.5 92.25,61 | 92.25,61 92.25,51 | v92.36,51 92.25,51
  Bottom 0.2: v94.75,50.75 arc90 94.5,51 v92.36,51
KEYIN2  (via drill 0.3)
  Top 0.2: JP2.25 74.13,2.55 arc90 74.63,2.05 91.25,2.05 92,2.05 arc90 92.5,2.55 92.5,24.75 arc-90 93,25.25 94.75,25.25 arc90 95.25,25.75 95.25,50 arc-90 95.5,50.25 arc90 95.75,50.5 95.75,51.25 arc90 95.25,51.75 v94.75,51.75 | Q4.1 82.3,44 | 82.3,44 Q5.1 | 82.3,44 82.3,50.25 arc-90 82.8,50.75 89.5,50.75 arc90 90,51.25 v90,51.75 90,58.9 90,70.25 arc90 89.5,70.75 89.1,70.75 | S2.3 75.74,84 arc90 76.24,83.5 90.75,83.5 arc-90 91.25,83 91.25,78.5 arc-90 90.75,78 89.6,78 arc90 89.1,77.5 89.1,70.75 | 89.1,70.75 R2.2
  Bottom 0.2: v94.75,51.75 v90,51.75
KEYIN3  (via drill 0.3)
  Top 0.2: R3.2 89,66.85 89,68.25 arc90 88.75,68.5 arc-90 88.25,69 | JP2.24 71.59,2.15 arc90 72.09,1.65 91.25,1.65 92.5,1.65 arc90 93,2.15 93,24.25 arc-90 93.5,24.75 95.25,24.75 arc90 95.75,25.25 95.75,49.5 arc-90 96,49.75 arc90 96.25,50 96.25,52.25 arc90 95.75,52.75 v94.75,52.75 | Q7.1 Q6.1 78.3,50.5 arc-90 78.8,51.25 87.75,51.25 arc90 88.25,51.75 88.25,52.75 | S3.3 68.74,84.5 arc90 69.24,84 69.5,84 arc-2 73.25,84 73.5,84 arc-90 74,83.5 arc90 74.5,83 85,83 arc-90 85.5,82.5 85.5,78.5 arc90 86,78 87.75,78 arc-90 88.25,77.5 88.25,69 | 88.25,59.05 88.25,58.75 | 88.25,58.75 88.25,52.75 | v88.75,52.75 88.25,52.75 | 88.25,69 88.25,58.75
  Bottom 0.2: v94.75,52.75 v88.75,52.75
KEYIN4  (via drill 0.3, 0.3 pad 0.3)
  Top 0.2: 85,69.85 R4.2 arc-90 85,69.85 | JP2.23 69.05,1.75 arc90 69.55,1.25 92,1.25 93,1.25 arc90 93.5,1.75 93.5,23.75 arc-90 94,24.25 95.75,24.25 arc90 96.25,24.75 96.25,49.25 arc-90 96.5,49.5 arc90 96.75,49.75 96.75,53.25 arc90 96.25,53.75 v94.75,53.75 | Q10.1 Q9.1 Q8.1 74.3,51.75 arc-90 74.8,52.25 85,52.25 85.5,52.25 arc90 86,52.75 v86,60.5 86,70 arc90 85.25,70.75 85,70.75 | 85.25,70.1 arc-90 85,69.85 | S4.3 61.74,84 arc90 62.24,83.5 72.25,83.5 73,83.5 arc-90 73.5,83 arc90 74,82.5 84.5,82.5 arc-90 85,82 85,70.75 | 85,70.75 85,69.85
  Bottom 0.2: v94.75,53.75 88.25,53.75 arc-90 87.75,54.25 87.75,60 arc90 87.25,60.5 v86,60.5
KEYIN5  (via drill 0.3 pad 0.3)
  Top 0.2: Q11.1 70.3,52.25 arc-90 70.8,52.75 84.15,52.75 arc90 84.65,53.25 v84.65,55.75 arc-90 84.25,56.15 84.25,68.75 | 84.25,68.75 arc90 84.5,68.5 84.6,68.5 arc-90 85.1,68 R5.2 | S5.3 54.74,83.5 arc90 55.24,83 72.25,83 72.5,83 arc-90 73,82.5 arc90 73.5,82 83.75,82 arc-90 84.25,81.5 84.25,68.75
  Bottom 0.2: JP2.22 66.51,3.35 arc90 67.01,2.85 91.75,2.85 arc90 92.25,3.35 92.25,47.75 arc90 91.75,48.25 85.15,48.25 arc-90 84.65,48.75 v84.65,55.75
KEYIN6  (via drill 0.3 pad 0.3)
  Top 0.2: 49.75,82.5 50,82.5 | 50,82.5 71.25,82.5 71.75,82.5 72,82.5 arc-90 72.5,82 arc90 73,81.5 77.75,81.5 arc-90 78.25,81 78.25,78.5 arc90 78.75,78 80.6,78 arc-90 81.1,77.5 81.1,70.75 | Q13.1 Q12.1 66.3,53.25 arc-90 66.8,53.75 81.5,53.75 arc90 82,54.25 v82,56.75 82,70.25 arc90 81.5,70.75 81.1,70.75 | 50,82.5 48.24,82.5 arc-90 47.74,83 S6.3 | 81.1,70.75 R6.2
  Bottom 0.2: JP2.21 63.97,2.95 arc90 64.47,2.45 92.25,2.45 arc90 92.75,2.95 92.75,48.25 arc90 92.25,48.75 86,48.75 arc-90 85.5,49.25 85.5,56.25 arc90 85,56.75 v82,56.75
KEYIN7  (via drill 0.3 pad 0.3)
  Top 0.2: 81,66.65 R7.2 81.1,67.9 arc90 80.75,68.25 80.5,68.25 arc-90 80.25,68.5 | 42.25,82 42.5,82 | 42.5,82 71,82 71.5,82 arc-90 72,81.5 arc90 72.5,81 77.25,81 arc-90 77.75,80.5 77.75,78 arc90 78.25,77.5 79.75,77.5 arc-90 80.25,77 80.25,68.5 | Q15.1 Q14.1 62.3,53.75 arc-90 62.8,54.25 80.15,54.25 arc90 80.65,54.75 v80.65,57.75 arc-90 80.25,58.15 80.25,68.5 | 42.5,82 41.24,82 arc-90 40.74,82.5 S7.3
  Bottom 0.2: JP2.20 61.43,2.55 arc90 61.93,2.05 92.75,2.05 arc90 93.25,2.55 93.25,48.75 arc90 92.75,49.25 86.5,49.25 arc-90 86,49.75 86,57.25 arc90 85.5,57.75 v80.65,57.75
KEYIN8  (via drill 0.3 pad 0.3)
  Top 0.2: S8.3 33.74,82.75 | 33.74,82.75 33.74,82.45 | 36.25,81.5 36.75,81.5 | 36.75,81.5 70,81.5 70.75,81.5 arc-90 71.25,81 71.25,70.25 arc90 71.75,69.75 76.25,69.75 | Q18.1 Q17.1 Q16.1 58.3,54.75 arc-90 58.8,55.25 76.75,55.25 arc90 77.25,55.75 v77.25,59 77.25,64.5 arc-90 77.5,64.75 arc90 78,65.25 78,68 arc90 77.75,68.25 76.5,68.25 arc-90 76.25,68.5 76.25,69.75 | 36.75,81.5 34.24,81.5 arc-90 33.74,82 33.74,82.75 | 76.25,69.75 R8.2
  Bottom 0.2: v77.25,59 77.75,58.99 86,58.99 arc-90 86.5,58.49 86.5,50.25 arc90 87,49.75 93.25,49.75 arc-90 93.75,49.25 93.75,2.15 arc-90 93.25,1.65 59.39,1.65 arc-90 58.89,2.15 JP2.19
KEYIN9  (via drill 0.3 pad 0.3)
  Top 0.2: 60.95,55.75 61.5,55.75 | S9.3 26.74,82.25 | 26.74,82.25 26.74,82.05 | 28.25,81 28.5,81 | 28.5,81 68.75,81 70,81 arc-90 70.5,80.5 70.5,67.25 arc90 71,66.75 76.25,66.75 | 61.5,55.75 54.8,55.75 arc90 54.3,55.25 Q19.1 Q20.1 | 28.5,81 27.24,81 arc-90 26.74,81.5 26.74,82.25 | 76.25,66.75 R9.2 | 76.25,66.75 v76.25,59.75 76.25,56.25 arc-90 75.75,55.75 61.5,55.75
  Bottom 0.2: 86.5,59.75 77,59.75 | 77,59.75 v76.25,59.75 | JP2.18 56.35,1.75 arc90 56.85,1.25 93.75,1.25 arc90 94.25,1.75 94.25,48.75 94.25,49.75 arc90 93.75,50.25 87.5,50.25 arc-90 87,50.75 87,59.25 arc90 86.5,59.75 | 77,59.75 86.5,59.75
KEYIN10  (via drill 0.3 pad 0.3)
  Top 0.2: R20.2 11.15,71.35 | 11.15,71.35 10.75,71.35 arc90 10.25,70.85 v10.25,59.25 10.75,59.25 arc-90 11.25,58.75 11.25,42.55 arc90 11.75,42.05 Q31.1 | 11.15,71.35 11.15,77.65 arc90 10.65,78.15 9.35,78.15 arc-90 8.85,78.65 8.85,82.25 arc-90 9.35,82.75 19.24,82.75 arc90 19.74,83.25 S10.3 | JP2.17 53.81,1.75 arc-90 53.31,1.25 10.25,1.25 arc-90 9.75,1.75 9.75,6.5 arc90 9.25,7 5,7 arc-90 4.5,7.5 4.5,58.75 arc-90 5,59.25 v5.5,59.25
  Bottom 0.2: v5.5,59.25 v10.25,59.25
KEYIN11  (via drill 0.3 pad 0.3)
  Top 0.2: 7.25,66.65 R21.2 7.15,66.25 arc90 7.65,65.75 8.25,65.75 | S11.3 12.74,84.25 arc-90 12.24,83.75 8.75,83.75 arc90 8.25,83.25 8.25,65.75 | JP2.16 51.27,2.15 arc-90 50.77,1.65 10.75,1.65 arc-90 10.25,2.15 10.25,7 arc90 9.75,7.5 5.5,7.5 arc-90 5,8 5,57.5 arc-90 v5.5,58 | 8.25,65.75 v8.25,57.5 8.25,47.6 arc90 Q32.1
  Bottom 0.2: v8.25,57.5 8.19,57.52 arc90 7.71,58 v5.5,58
KEYIN12
  Top 0.2: 7.45,71.35 7.45,70.05 R22.2 | 7.45,71.35 6.75,71.35 arc90 6.25,70.85 6.25,57.25 | 7.45,71.35 7.45,83.25 arc90 6.95,83.75 6.24,83.75 arc-90 5.74,84.25 S12.3 | JP2.15 48.73,2.55 arc-90 48.23,2.05 11.25,2.05 arc-90 10.75,2.55 10.75,7.5 arc90 10.25,8 6,8 arc-90 5.5,8.5 5.5,55.3 5.47,55.32 5.47,56.75 arc-90 5.97,57.25 6.25,57.25 | Q33.1 7.75,42.05 arc-90 7.25,42.55 7.25,56.75 arc90 6.75,57.25 6.25,57.25
KEYIN13  (via drill 0.3, 0.3 pad 0.3)
  Top 0.2: 11.25,66.65 R23.2 11.15,66.25 arc90 11.65,65.75 12.25,65.75 | S13.3 68.74,77.65 arc90 68.24,78.15 12.75,78.15 arc90 12.25,77.65 12.25,65.75 | JP2.14 46.19,2.95 arc-90 45.69,2.45 11.75,2.45 arc-90 11.25,2.95 11.25,8 arc90 10.75,8.5 6.5,8.5 arc-90 6,9 6,55.36 5.87,55.49 5.87,56.15 arc-90 6.37,56.65 v6.5,56.65 | 12.25,65.75 v12.25,58.25 12.25,47.6 arc90 Q36.1
  Bottom 0.2: v12.25,58.25 12.25,57.15 arc-90 11.75,56.65 v6.5,56.65
KEYIN14  (via drill 0.3 pad 0.3)
  Top 0.2: 15.15,71.55 R24.2 | 15.15,71.55 15.15,77.25 arc-90 15.65,77.75 61.24,77.75 arc-90 61.74,77.25 S14.3 | 15.15,71.55 14.75,71.55 arc90 14.25,71.05 v14.25,57.75 14.75,57.75 arc-90 15.25,57.25 15.25,42.55 arc90 15.75,42.05 Q37.1 | JP2.13 43.65,3.35 arc-90 43.15,2.85 12.25,2.85 arc-90 11.75,3.35 11.75,8.5 arc90 11.25,9 7,9 arc-90 6.5,9.5 v6.5,55.75
  Bottom 0.2: v14.25,57.75 14.25,56.25 arc-90 13.75,55.75 v6.5,55.75
KEYIN15  (via drill 0.3 pad 0.3)
  Top 0.2: 15.25,66.65 R25.2 15.15,66.25 arc90 15.65,65.75 16.25,65.75 | S15.3 54.74,76.85 arc90 54.24,77.35 16.75,77.35 arc90 16.25,76.85 16.25,65.75 | 16.25,65.75 v16.25,57.25 arc-90 16.3,57.2 Q38.1
  Bottom 0.2: JP2.12 41.11,1.75 arc-90 40.61,1.25 7.75,1.25 arc-90 7.25,1.75 7.25,3.25 7.25,52.5 7.25,54.25 arc-90 7.75,54.75 15.75,54.75 arc90 16.25,55.25 v16.25,57.25
KEYIN16  (via drill 0.3 pad 0.3)
  Top 0.2: 19.15,71.35 R26.2 | 19.15,71.35 18.75,71.35 arc90 18.25,70.85 v18.25,56.75 18.75,56.75 arc-90 19.25,56.25 19.25,42.55 arc90 19.75,42.05 Q39.1 | 19.15,71.35 19.15,76.45 arc-90 19.65,76.95 47.24,76.95 arc-90 47.74,76.45 S16.3
  Bottom 0.2: JP2.11 38.57,2.15 arc-90 38.07,1.65 8.25,1.65 arc-90 7.75,2.15 7.75,3.5 7.75,52.75 7.75,53.75 arc-90 8.25,54.25 17.75,54.25 arc90 18.25,54.75 v18.25,56.75
KEYIN17  (via drill 0.3 pad 0.3)
  Top 0.2: 19.25,66.65 R27.2 19.15,66.25 arc90 19.65,65.75 20.25,65.75 | S17.3 40.74,76.05 arc90 40.24,76.55 20.75,76.55 arc90 20.25,76.05 20.25,65.75 | 20.25,65.75 v20.25,56.25 arc-90 20.3,56.2 Q40.1
  Bottom 0.2: JP2.10 36.03,2.55 arc-90 35.53,2.05 8.75,2.05 arc-90 8.25,2.55 8.25,3.5 8.25,52 8.25,53.25 arc-90 8.75,53.75 19.75,53.75 arc90 20.25,54.25 v20.25,56.25
KEYIN18  (via drill 0.3 pad 0.3)
  Top 0.2: R28.2 23.15,71.35 | 23.15,71.35 22.75,71.35 arc90 22.25,70.85 v22.25,55.75 22.75,55.75 arc-90 23.25,55.25 23.25,42.55 arc90 23.75,42.05 Q41.1 | S18.3 33.74,75.65 arc90 33.24,76.15 23.65,76.15 arc90 23.15,75.65 23.15,71.35
  Bottom 0.2: JP2.9 33.49,2.95 arc-90 32.99,2.45 9.25,2.45 | 9.25,2.45 9.21,2.45 | 9.21,53.25 9.25,53.25 | 9.25,53.25 10,53.25 | 9.25,2.45 arc-90 8.75,2.95 8.75,52.75 arc-90 9.25,53.25 | 9.25,53.25 10,53.25 | v22.25,55.75 22.25,53.75 arc-90 21.75,53.25 10,53.25
KEYIN19  (via drill 0.3 pad 0.3)
  Top 0.2: 23.25,66.65 R29.2 23.15,66.25 arc90 23.65,65.75 24.25,65.75 | 24.25,65.75 v24.25,55.25 arc-90 24.3,55.2 Q42.1 | 24.25,65.75 24.25,72.5 arc-90 24.75,73 26.24,73 arc-90 26.74,72.5 S19.3
  Bottom 0.2: JP2.8 30.95,3.35 arc-90 30.45,2.85 9.75,2.85 arc-90 9.25,3.35 9.25,52.25 arc-90 9.75,52.75 23.75,52.75 arc90 24.25,53.25 v24.25,55.25
N$1
  Top 0.2: Q43.3 14,18.75 | 14,18.75 R30.1 | R31.1 14,18.75
N$17
  Top 0.2: Q44.3 23.5,22.25 | 23.5,22.25 R32.1 | R33.1 23.5,22.25
N$23
  Top 0.2: R33.2 C3.1 arc90 29.7,22.05 Q30.1
N$24
  Top 0.2: R31.2 C2.1 arc90 20.2,18.55 Q44.1 22.55,17.55 arc90 23.05,17.05 Q34.1
N$25
  Top 0.2: Q34.3 33.45,19.45 arc90 33.95,19.95 Q30.2
STB
  Top 0.2: Q35.3 38,25.75 | 38,25.75 R35.1 | 38,25.75 41,25.75 arc-90 41.5,25.25 41.5,18.75 arc90 42,18.25 44,18.25 arc-90 44.5,17.75 44.5,14.75 arc-90 44,14.25 23.83,14.25 arc90 23.33,13.75 JP2.5
VCC  (via drill 0.3 pad 0.3)
  Top 0.2: R14.2 arc-90 42.65,44.25 v40.25,44.25 | R15.2 arc-90 42.65,39.25 v40.25,39.25 | R16.2 arc-90 42.65,34.25 v40.25,34.25 | R17.2 arc-90 42.65,29.25 v40.25,29.25 | R10.2 52.75,46.15 arc-90 53.25,45.65 53.25,41.25 | 52.75,31.15 R13.2 53.15,31.15 arc90 53.25,31.25 | 53.25,41.25 53.25,36.25 | R12.2 arc-90 52.35,36.25 53.25,36.25 | R11.2 arc-90 52.35,41.25 53.25,41.25 | 53.25,31.25 53.25,36.25 | R18.2 26.75,36.35 | R30.2 14,22.75 | R32.2 23.5,26.25 | R35.2 38,29.75 | 53.25,31.25 53.25,26.75 | R34.2 33,29.75 | R19.2 44.5,26.75 | C1.1 82.25,10
  Top 0.4: 26.75,36.35 arc90 27.25,36.85 27.25,48.25 arc-90 27.75,48.75 v40.25,48.75 | 14,22.75 21,22.75 arc90 21.5,23.25 21.5,25.75 arc-90 22,26.25 23.5,26.25 31,26.25 arc90 31.5,26.75 31.5,29.25 arc-90 32,29.75 33,29.75 38,29.75 39.75,29.75 arc-90 v40.25,29.25 40.25,27.75 arc90 41.25,26.75 44.25,26.75 | 53.25,26.75 49.25,26.75 | 49.25,26.75 44.5,26.75 44.25,26.75 | 44.25,26.75 44,26.75 | JP2.29 84.29,7.5 arc90 83.79,8 82.75,8 arc-90 82.25,8.5 82.25,10 82.25,26.25 arc90 81.75,26.75 49.25,26.75
  Bottom 0.2: 52.25,85.49 S6.1 | S18.1 arc90 38,71.24 | S17.1 arc90 45,71.24 | S16.1 arc90 52,71.24 | S15.1 arc90 59,71.24 | S14.1 arc90 66,71.24
  Bottom 0.4: v40.25,29.25 v40.25,34.25 v40.25,39.25 v40.25,44.25 v40.25,48.75 42,48.75 arc90 43,49.75 43,69.75 | S0.1 94.51,84.5 arc-90 94.01,84 87.25,84 | S12.1 10.51,84.5 arc90 11.01,84 17.25,84 | 87.25,84 80.25,84 | 80.25,84 73.25,84 | 73.25,84 66.25,84 | 66.25,84 59.25,84 | 59.25,84 52.25,84 | 52.25,84 50.25,84 45.25,84 | 45.25,84 43,84 | 43,84 38.25,84 | 38.25,84 31.25,84 | 31.25,84 24.25,84 | 24.25,84 17.25,84 | 17.25,84 17.25,85.49 S11.1 | 24.25,84 24.25,85.49 S10.1 | 31.25,84 31.25,85.49 S9.1 | 38.25,84 38.25,85.49 S8.1 | 45.25,84 45.25,85.49 S7.1 | 52.25,84 52.25,85.49 | 59.25,84 59.25,85.49 S5.1 | 66.25,84 66.25,85.49 S4.1 | 73.25,84 73.25,85.49 S3.1 | 80.25,84 80.25,85.49 S2.1 | 87.25,84 87.25,85.49 S1.1 | S13.1 73.26,70.25 arc-90 72.76,69.75 66,69.75 | S19.1 31.26,70.25 arc90 31.76,69.75 38,69.75 | 66,69.75 59,69.75 | 59,69.75 52,69.75 | 52,69.75 45,69.75 | 45,69.75 43,69.75 | 43,69.75 38,69.75 | 38,71.24 38,69.75 | 45,71.24 45,69.75 | 52,71.24 52,69.75 | 59,71.24 59,69.75 | 66,71.24 66,69.75 | 43,69.75 43,84

### Text on the board
tPlace: = | c | . | 9 | 8 | 7 | 6 | 5 | 4 | 3 | 2 | 1 | 0 | AC | MR | MS | / | * | - | + | D0 | D1 | D2 | D3 | STB | AKD | KEYIN19 | KEYIN18 | KEYIN17 | KEYIN16 | KEYIN15 | KEYIN14 | KEYIN13 | KEYIN12 | KEYIN11 | KEYIN10 | KEYIN9 | KEYIN8 | KEYIN7 | KEYIN6 | KEYIN5 | KEYIN4 | KEYIN3 | KEYIN2 | KEYIN1 | KEYIN0
bPlace: SmallRoomLabs | Xxxxxx / yyyyy / rev1 | D0 | D1 | D2 | D3 | STB | AKD | KEYIN19 | KEYIN18 | KEYIN17 | KEYIN16 | KEYIN15 | KEYIN14 | KEYIN13 | KEYIN12 | KEYIN11 | KEYIN10 | KEYIN9 | KEYIN8 | KEYIN7 | KEYIN6 | KEYIN5 | KEYIN4 | KEYIN3 | KEYIN2 | KEYIN1 | KEYIN0
Reference: 44T 36R 3C